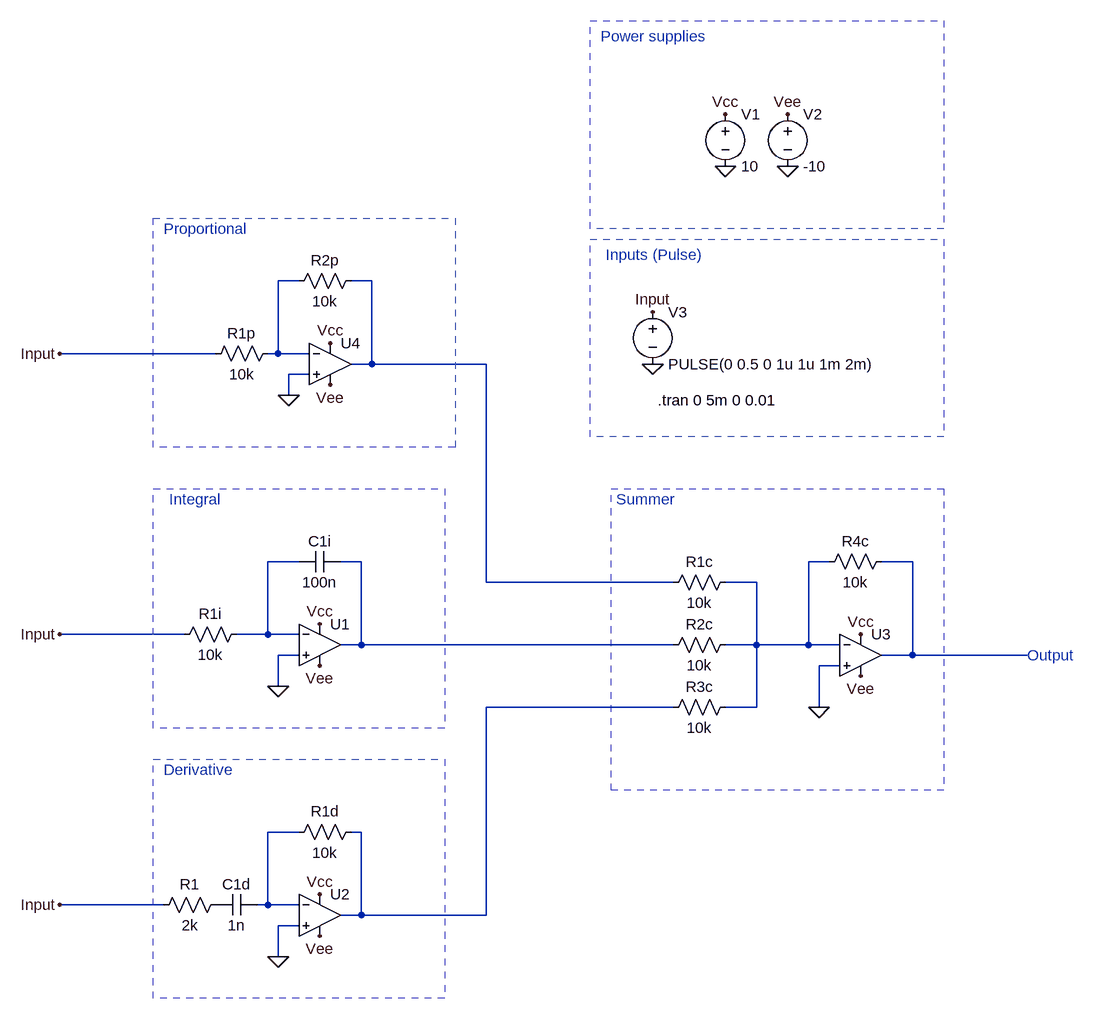
[diagram p0: schematic model_LTSPICE.asc]
model_LTSPICE.asc, the LTspice schematic file:
Version 4
SHEET 1 1576 916
WIRE -32 -192 -64 -192
WIRE 80 -192 48 -192
WIRE -160 -80 -400 -80
WIRE -64 -80 -64 -192
WIRE -64 -80 -80 -80
WIRE -16 -80 -64 -80
WIRE 80 -64 80 -192
WIRE 80 -64 48 -64
WIRE 256 -64 80 -64
WIRE -16 -48 -48 -48
WIRE -48 -16 -48 -48
WIRE -32 240 -80 240
WIRE 64 240 32 240
WIRE 784 240 752 240
WIRE 912 240 864 240
WIRE 256 272 256 -64
WIRE 544 272 256 272
WIRE 672 272 624 272
WIRE -208 352 -400 352
WIRE -80 352 -80 240
WIRE -80 352 -128 352
WIRE -32 352 -80 352
WIRE 64 368 64 240
WIRE 64 368 32 368
WIRE 544 368 64 368
WIRE 672 368 672 272
WIRE 672 368 624 368
WIRE 752 368 752 240
WIRE 752 368 672 368
WIRE 800 368 752 368
WIRE -32 384 -64 384
WIRE 912 384 912 240
WIRE 912 384 864 384
WIRE 1088 384 912 384
WIRE 800 400 768 400
WIRE -64 432 -64 384
WIRE 544 464 256 464
WIRE 672 464 672 368
WIRE 672 464 624 464
WIRE 768 464 768 400
WIRE -32 656 -80 656
WIRE 64 656 48 656
WIRE -240 768 -400 768
WIRE -80 768 -80 656
WIRE -80 768 -96 768
WIRE -32 768 -80 768
WIRE 64 784 64 656
WIRE 64 784 32 784
WIRE 256 784 256 464
WIRE 256 784 64 784
WIRE -32 800 -64 800
WIRE -64 848 -64 800
FLAG 768 464 0
FLAG -64 432 0
FLAG -64 848 0
FLAG -48 -16 0
FLAG 624 -368 0
FLAG 720 -368 0
FLAG 624 -448 Vcc
FLAG 720 -448 Vee
FLAG 16 -96 Vcc
FLAG 0 336 Vcc
FLAG 0 752 Vcc
FLAG 832 352 Vcc
FLAG 16 -32 Vee
FLAG 0 400 Vee
FLAG 0 816 Vee
FLAG 832 416 Vee
FLAG 512 -64 0
FLAG 512 -144 Input
FLAG -400 -80 Input
FLAG -400 352 Input
FLAG -400 768 Input
SYMBOL res 640 352 R90
WINDOW 0 0 56 VBottom 2
WINDOW 3 32 56 VTop 2
SYMATTR InstName R2c
SYMATTR Value 10k
SYMBOL res 640 256 R90
WINDOW 0 0 56 VBottom 2
WINDOW 3 32 56 VTop 2
SYMATTR InstName R1c
SYMATTR Value 10k
SYMBOL res 640 448 R90
WINDOW 0 0 56 VBottom 2
WINDOW 3 32 56 VTop 2
SYMATTR InstName R3c
SYMATTR Value 10k
SYMBOL res -64 -96 R90
WINDOW 0 0 56 VBottom 2
WINDOW 3 32 56 VTop 2
SYMATTR InstName R1p
SYMATTR Value 10k
SYMBOL res 64 -208 R90
WINDOW 0 0 56 VBottom 2
WINDOW 3 32 56 VTop 2
SYMATTR InstName R2p
SYMATTR Value 10k
SYMBOL res -112 336 R90
WINDOW 0 0 56 VBottom 2
WINDOW 3 32 56 VTop 2
SYMATTR InstName R1i
SYMATTR Value 10k
SYMBOL res 64 640 R90
WINDOW 0 0 56 VBottom 2
WINDOW 3 32 56 VTop 2
SYMATTR InstName R1d
SYMATTR Value 10k
SYMBOL cap 32 224 R90
WINDOW 0 0 32 VBottom 2
WINDOW 3 32 32 VTop 2
SYMATTR InstName C1i
SYMATTR Value 100n
SYMBOL cap -96 752 R90
WINDOW 0 0 32 VBottom 2
WINDOW 3 32 32 VTop 2
SYMATTR InstName C1d
SYMATTR Value 1n
SYMBOL res 880 224 R90
WINDOW 0 0 56 VBottom 2
WINDOW 3 32 56 VTop 2
SYMATTR InstName R4c
SYMATTR Value 10k
SYMBOL voltage 624 -464 R0
WINDOW 123 0 0 Left 0
WINDOW 39 0 0 Left 0
SYMATTR InstName V1
SYMATTR Value 10
SYMBOL voltage 720 -464 R0
WINDOW 123 0 0 Left 0
WINDOW 39 0 0 Left 0
SYMATTR InstName V2
SYMATTR Value -10
SYMBOL voltage 512 -160 R0
WINDOW 123 0 0 Left 0
WINDOW 39 0 0 Left 0
SYMATTR InstName V3
SYMATTR Value PULSE(0 0.5 0 1u 1u 1m 2m)
SYMBOL OpAmps\\UniversalOpamp2 0 368 R0
SYMATTR InstName U1
SYMBOL OpAmps\\UniversalOpamp2 0 784 R0
SYMATTR InstName U2
SYMBOL OpAmps\\UniversalOpamp2 832 384 R0
SYMATTR InstName U3
SYMBOL OpAmps\\UniversalOpamp2 16 -64 R0
SYMATTR InstName U4
SYMBOL res -144 752 R90
WINDOW 0 0 56 VBottom 2
WINDOW 3 32 56 VTop 2
SYMATTR InstName R1
SYMATTR Value 2k
TEXT 520 -8 Left 2 !.tran 0 5m 0 0.01
TEXT -240 -272 Left 2 ;Proportional
TEXT -232 144 Left 2 ;Integral
TEXT -240 560 Left 2 ;Derivative
TEXT 456 144 Left 2 ;Summer
TEXT 1088 384 Left 2 ;Output
TEXT 432 -568 Left 2 ;Power supplies
TEXT 440 -232 Left 2 ;Inputs (Pulse)
RECTANGLE Normal 208 64 -256 -288 2
RECTANGLE Normal 192 496 -256 128 2
RECTANGLE Normal 192 912 -256 544 2
RECTANGLE Normal 960 592 448 128 2
RECTANGLE Normal 960 48 416 -256 2
RECTANGLE Normal 960 -272 416 -592 2

The netlist it stands for:
* model_LTSPICE.asc
R2c N005 N004 10k
R1c N005 N002 10k
R3c N005 N007 10k
R1p N001 Input 10k
R2p N002 N001 10k
R1i N003 Input 10k
R1d N007 N008 10k
C1i N004 N003 100n
C1d N008 P001 1n
R4c N006 N005 10k
V1 Vcc 0 10
V2 Vee 0 -10
V3 Input 0 PULSE(0 0.5 0 1u 1u 1m 2m)
XU1 0 N003 Vcc Vee N004 level.2 Avol=1Meg GBW=10Meg Slew=10Meg ilimit=25m rail=0 Vos=0 phimargin=45 en=0 enk=0 in=0 ink=0 Rin=500Meg  ; pins IN+ IN- V+ V- OUT
XU2 0 N008 Vcc Vee N007 level.2 Avol=1Meg GBW=10Meg Slew=10Meg ilimit=25m rail=0 Vos=0 phimargin=45 en=0 enk=0 in=0 ink=0 Rin=500Meg  ; pins IN+ IN- V+ V- OUT
XU3 0 N005 Vcc Vee N006 level.2 Avol=1Meg GBW=10Meg Slew=10Meg ilimit=25m rail=0 Vos=0 phimargin=45 en=0 enk=0 in=0 ink=0 Rin=500Meg  ; pins IN+ IN- V+ V- OUT
XU4 0 N001 Vcc Vee N002 level.2 Avol=1Meg GBW=10Meg Slew=10Meg ilimit=25m rail=0 Vos=0 phimargin=45 en=0 enk=0 in=0 ink=0 Rin=500Meg  ; pins IN+ IN- V+ V- OUT
R1 P001 Input 2k
.tran 0 5m 0 0.01
* Proportional
* Integral
* Derivative
* Summer
* Output
* Power supplies
* Inputs (Pulse)
.lib UniversalOpamps2.sub
.backanno
.end